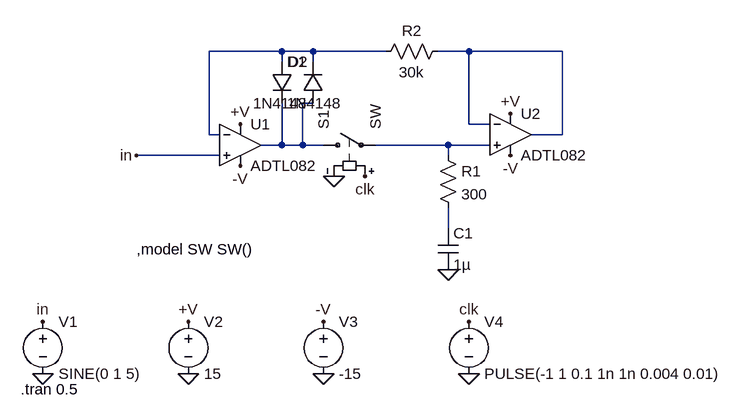
[diagram p0: schematic sample_and_hold.asc]
sample_and_hold.asc, the LTspice schematic file:
Version 4
SHEET 1 880 680
WIRE 128 16 16 16
WIRE 176 16 128 16
WIRE 288 16 176 16
WIRE 416 16 368 16
WIRE 560 16 416 16
WIRE 128 32 128 16
WIRE 176 32 176 16
WIRE 176 96 160 96
WIRE 416 128 416 16
WIRE 448 128 416 128
WIRE 16 144 16 16
WIRE 32 144 16 144
WIRE 560 144 560 16
WIRE 560 144 512 144
WIRE 128 160 128 96
WIRE 128 160 96 160
WIRE 160 160 160 96
WIRE 160 160 128 160
WIRE 192 160 160 160
WIRE 384 160 272 160
WIRE 448 160 384 160
WIRE 32 176 -96 176
WIRE 384 176 384 160
WIRE 384 288 384 256
FLAG 384 352 0
FLAG 208 208 0
FLAG 416 512 0
FLAG 192 512 0
FLAG -16 512 0
FLAG -240 512 0
FLAG -16 432 +V
FLAG 64 128 +V
FLAG 480 112 +V
FLAG 192 432 -V
FLAG 480 176 -V
FLAG 64 192 -V
FLAG -96 176 in
FLAG -240 432 in
FLAG 416 432 clk
FLAG 256 208 clk
SYMBOL Opamps\\ADTL082 64 96 R0
SYMATTR InstName U1
SYMBOL Opamps\\ADTL082 480 80 R0
SYMATTR InstName U2
SYMBOL sw 176 160 R270
SYMATTR InstName S1
SYMBOL res 368 160 R0
SYMATTR InstName R1
SYMATTR Value 300
SYMBOL cap 368 288 R0
SYMATTR InstName C1
SYMATTR Value 1µ
SYMBOL res 384 0 R90
WINDOW 0 0 56 VBottom 2
WINDOW 3 32 56 VTop 2
SYMATTR InstName R2
SYMATTR Value 30k
SYMBOL diode 112 32 R0
SYMATTR InstName D1
SYMATTR Value 1N4148
SYMBOL diode 192 96 R180
WINDOW 0 24 64 Left 2
WINDOW 3 24 0 Left 2
SYMATTR InstName D2
SYMATTR Value 1N4148
SYMBOL voltage -240 416 R0
WINDOW 123 0 0 Left 0
WINDOW 39 0 0 Left 0
SYMATTR InstName V1
SYMATTR Value SINE(0 1 5)
SYMBOL voltage -16 416 R0
WINDOW 123 0 0 Left 0
WINDOW 39 0 0 Left 0
SYMATTR InstName V2
SYMATTR Value 15
SYMBOL voltage 192 416 R0
WINDOW 123 0 0 Left 0
WINDOW 39 0 0 Left 0
SYMATTR InstName V3
SYMATTR Value -15
SYMBOL voltage 416 416 R0
WINDOW 123 0 0 Left 0
WINDOW 39 0 0 Left 0
SYMATTR InstName V4
SYMATTR Value PULSE(-1 1 0.1 1n 1n 0.004 0.01)
TEXT -274 536 Left 2 !.tran 0.5
TEXT -96 320 Left 2 !,model SW SW()

The netlist it stands for:
* sample_and_hold.asc
XU1 in N001 +V -V N003 ADTL082  ; pins In+ In- V+ V- OUT
XU2 N004 N002 +V -V N002 ADTL082  ; pins In+ In- V+ V- OUT
S1 N003 N004 clk 0 SW
R1 N004 N005 300
C1 N005 0 1µ
R2 N002 N001 30k
D1 N001 N003 1N4148
D2 N003 N001 1N4148
V1 in 0 SINE(0 1 5)
V2 +V 0 15
V3 -V 0 -15
V4 clk 0 PULSE(-1 1 0.1 1n 1n 0.004 0.01)
.model D D
.lib standard.dio
.tran 0.5
,model SW SW()
.lib ADI.lib
.backanno
.end